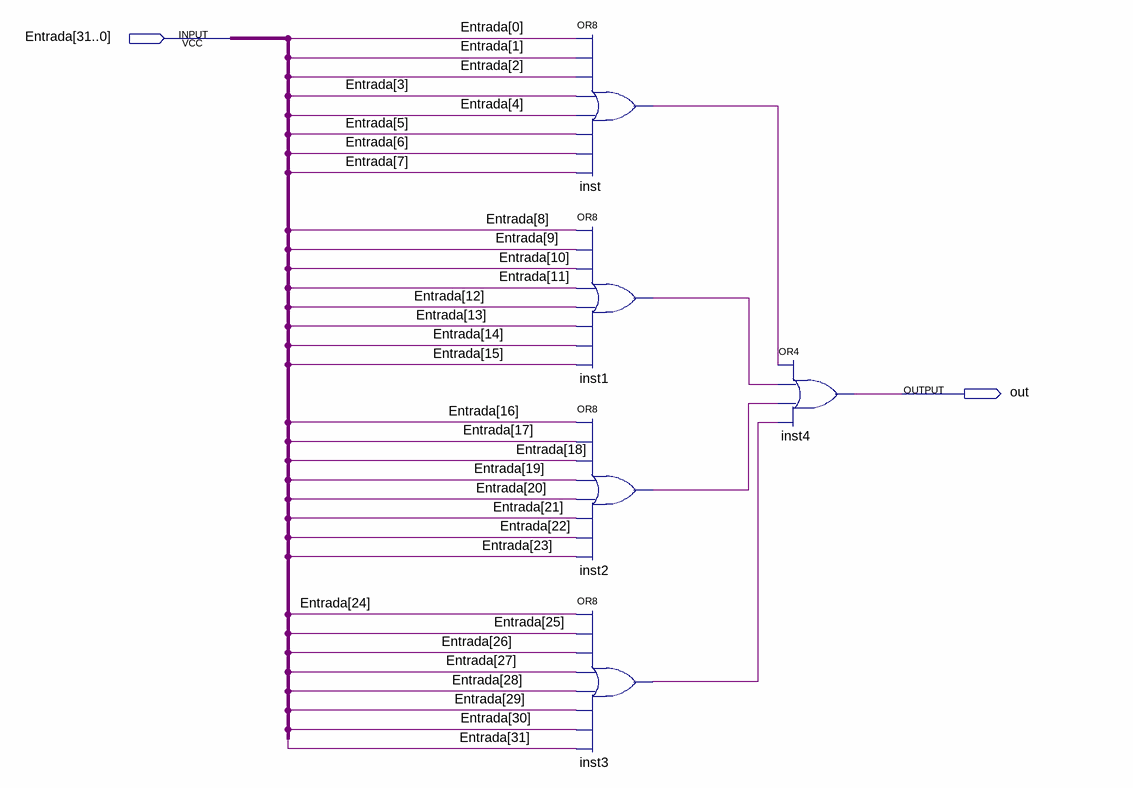
[diagram p0: schematic sheet]
// Quartus schematic or32.bdf as structural Verilog: 5 symbols, 2 pins
module or32 (
  input  [31:0] Entrada,
  output out
);

  wire inst1_out, inst2_out, inst3_out, inst_out;

  or inst (inst_out, Entrada[0], Entrada[1], Entrada[2], Entrada[3], Entrada[4], Entrada[5], Entrada[6], Entrada[7]);
  or inst1 (inst1_out, Entrada[8], Entrada[9], Entrada[10], Entrada[11], Entrada[12], Entrada[13], Entrada[14], Entrada[15]);
  or inst2 (inst2_out, Entrada[16], Entrada[17], Entrada[18], Entrada[19], Entrada[20], Entrada[21], Entrada[22], Entrada[23]);
  or inst3 (inst3_out, Entrada[24], Entrada[25], Entrada[26], Entrada[27], Entrada[28], Entrada[29], Entrada[30], Entrada[31]);
  or inst4 (out, inst_out, inst1_out, inst2_out, inst3_out);
endmodule
